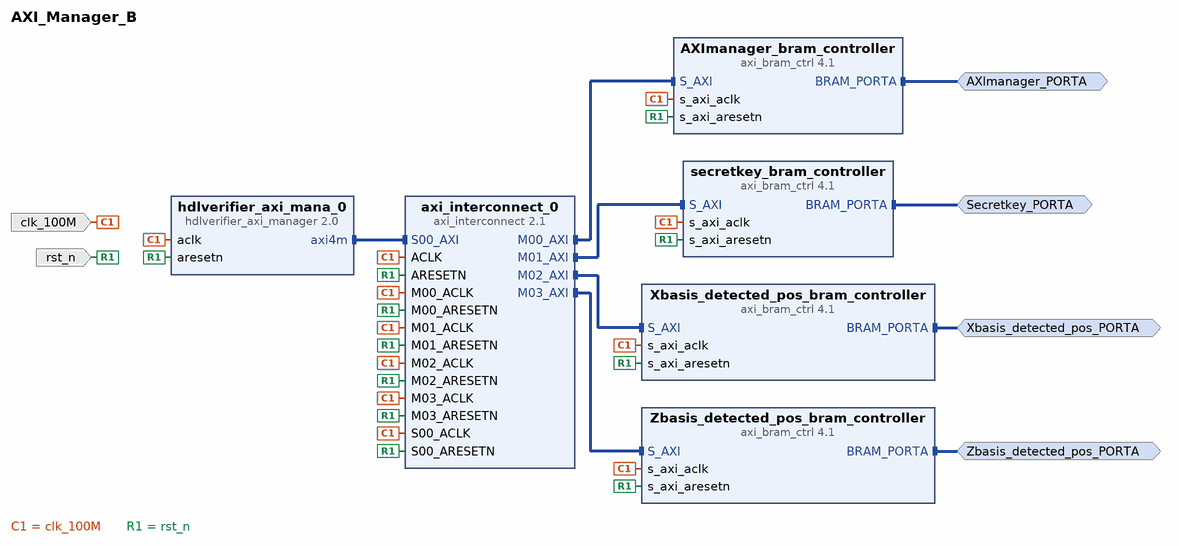
[diagram p0: block diagram of the top level]
# Vivado block design AXI_Manager_B, xcku5p-ffvb676-2-e, Vivado 2022.1
create_bd_design AXI_Manager_B

create_bd_intf_port -mode Master -vlnv xilinx.com:interface:bram_rtl:1.0 AXImanager_PORTA
set_property -dict {CONFIG.MASTER_TYPE BRAM_CTRL CONFIG.READ_WRITE_MODE READ_WRITE} [get_bd_intf_ports AXImanager_PORTA]
create_bd_intf_port -mode Master -vlnv xilinx.com:interface:bram_rtl:1.0 Secretkey_PORTA
set_property -dict {CONFIG.MASTER_TYPE BRAM_CTRL CONFIG.READ_WRITE_MODE READ_WRITE} [get_bd_intf_ports Secretkey_PORTA]
create_bd_intf_port -mode Master -vlnv xilinx.com:interface:bram_rtl:1.0 Xbasis_detected_pos_PORTA
set_property -dict {CONFIG.MASTER_TYPE BRAM_CTRL CONFIG.READ_WRITE_MODE READ_WRITE} [get_bd_intf_ports Xbasis_detected_pos_PORTA]
create_bd_intf_port -mode Master -vlnv xilinx.com:interface:bram_rtl:1.0 Zbasis_detected_pos_PORTA
set_property -dict {CONFIG.MASTER_TYPE BRAM_CTRL CONFIG.READ_WRITE_MODE READ_WRITE} [get_bd_intf_ports Zbasis_detected_pos_PORTA]
create_bd_port -dir I -type clk clk_100M
create_bd_port -dir I -type rst rst_n

create_bd_cell -type ip -vlnv mathworks.com:ip:hdlverifier_axi_manager:2.0 hdlverifier_axi_mana_0
set_property -dict {CONFIG.AXI_DATA_WIDTH 64} [get_bd_cells hdlverifier_axi_mana_0]
create_bd_cell -type ip -vlnv xilinx.com:ip:axi_interconnect:2.1 axi_interconnect_0
set_property -dict {CONFIG.NUM_MI 4} [get_bd_cells axi_interconnect_0]
create_bd_cell -type ip -vlnv xilinx.com:ip:axi_bram_ctrl:4.1 AXImanager_bram_controller
set_property -dict {CONFIG.DATA_WIDTH 64 CONFIG.SINGLE_PORT_BRAM 1} [get_bd_cells AXImanager_bram_controller]
create_bd_cell -type ip -vlnv xilinx.com:ip:axi_bram_ctrl:4.1 secretkey_bram_controller
set_property -dict {CONFIG.DATA_WIDTH 64 CONFIG.SINGLE_PORT_BRAM 1} [get_bd_cells secretkey_bram_controller]
create_bd_cell -type ip -vlnv xilinx.com:ip:axi_bram_ctrl:4.1 Zbasis_detected_pos_bram_controller
set_property -dict {CONFIG.DATA_WIDTH 64 CONFIG.SINGLE_PORT_BRAM 1} [get_bd_cells Zbasis_detected_pos_bram_controller]
create_bd_cell -type ip -vlnv xilinx.com:ip:axi_bram_ctrl:4.1 Xbasis_detected_pos_bram_controller
set_property -dict {CONFIG.DATA_WIDTH 64 CONFIG.SINGLE_PORT_BRAM 1} [get_bd_cells Xbasis_detected_pos_bram_controller]

# ---- connections ----

connect_bd_intf_net [get_bd_intf_ports AXImanager_PORTA] [get_bd_intf_pins AXImanager_bram_controller/BRAM_PORTA]
connect_bd_intf_net [get_bd_intf_ports Xbasis_detected_pos_PORTA] [get_bd_intf_pins Xbasis_detected_pos_bram_controller/BRAM_PORTA]
connect_bd_intf_net [get_bd_intf_ports Zbasis_detected_pos_PORTA] [get_bd_intf_pins Zbasis_detected_pos_bram_controller/BRAM_PORTA]
connect_bd_intf_net [get_bd_intf_pins axi_interconnect_0/M00_AXI] [get_bd_intf_pins AXImanager_bram_controller/S_AXI]
connect_bd_intf_net [get_bd_intf_pins axi_interconnect_0/M01_AXI] [get_bd_intf_pins secretkey_bram_controller/S_AXI]
connect_bd_intf_net [get_bd_intf_pins axi_interconnect_0/M02_AXI] [get_bd_intf_pins Xbasis_detected_pos_bram_controller/S_AXI]
connect_bd_intf_net [get_bd_intf_pins axi_interconnect_0/M03_AXI] [get_bd_intf_pins Zbasis_detected_pos_bram_controller/S_AXI]
connect_bd_intf_net [get_bd_intf_pins hdlverifier_axi_mana_0/axi4m] [get_bd_intf_pins axi_interconnect_0/S00_AXI]
connect_bd_intf_net [get_bd_intf_ports Secretkey_PORTA] [get_bd_intf_pins secretkey_bram_controller/BRAM_PORTA]
connect_bd_net -net aclk_0_1 [get_bd_ports clk_100M] \
  [get_bd_pins hdlverifier_axi_mana_0/aclk] [get_bd_pins axi_interconnect_0/ACLK] [get_bd_pins axi_interconnect_0/S00_ACLK] \
  [get_bd_pins axi_interconnect_0/M00_ACLK] [get_bd_pins axi_interconnect_0/M01_ACLK] \
  [get_bd_pins axi_interconnect_0/M02_ACLK] [get_bd_pins axi_interconnect_0/M03_ACLK] \
  [get_bd_pins secretkey_bram_controller/s_axi_aclk] [get_bd_pins AXImanager_bram_controller/s_axi_aclk] \
  [get_bd_pins Xbasis_detected_pos_bram_controller/s_axi_aclk] [get_bd_pins Zbasis_detected_pos_bram_controller/s_axi_aclk]
connect_bd_net -net aresetn_0_1 [get_bd_ports rst_n] \
  [get_bd_pins hdlverifier_axi_mana_0/aresetn] [get_bd_pins axi_interconnect_0/M02_ARESETN] \
  [get_bd_pins axi_interconnect_0/M03_ARESETN] [get_bd_pins axi_interconnect_0/M01_ARESETN] \
  [get_bd_pins axi_interconnect_0/S00_ARESETN] [get_bd_pins axi_interconnect_0/M00_ARESETN] \
  [get_bd_pins axi_interconnect_0/ARESETN] [get_bd_pins Zbasis_detected_pos_bram_controller/s_axi_aresetn] \
  [get_bd_pins Xbasis_detected_pos_bram_controller/s_axi_aresetn] [get_bd_pins secretkey_bram_controller/s_axi_aresetn] \
  [get_bd_pins AXImanager_bram_controller/s_axi_aresetn]

# ---- address map ----
assign_bd_address -offset 0x00000000 -range 256K -target_address_space [get_bd_addr_spaces hdlverifier_axi_mana_0/axi4m] [get_bd_addr_segs AXImanager_bram_controller/S_AXI/Mem0]
assign_bd_address -offset 0x10000000 -range 256K -target_address_space [get_bd_addr_spaces hdlverifier_axi_mana_0/axi4m] [get_bd_addr_segs secretkey_bram_controller/S_AXI/Mem0]
assign_bd_address -offset 0x40000000 -range 256K -target_address_space [get_bd_addr_spaces hdlverifier_axi_mana_0/axi4m] [get_bd_addr_segs Xbasis_detected_pos_bram_controller/S_AXI/Mem0]
assign_bd_address -offset 0x80000000 -range 8K -target_address_space [get_bd_addr_spaces hdlverifier_axi_mana_0/axi4m] [get_bd_addr_segs Zbasis_detected_pos_bram_controller/S_AXI/Mem0]

validate_bd_design
save_bd_design
